# Altium schematic sheet Demo1.SchDoc
size A4; SheetNumber: 1; SheetTotal: 1
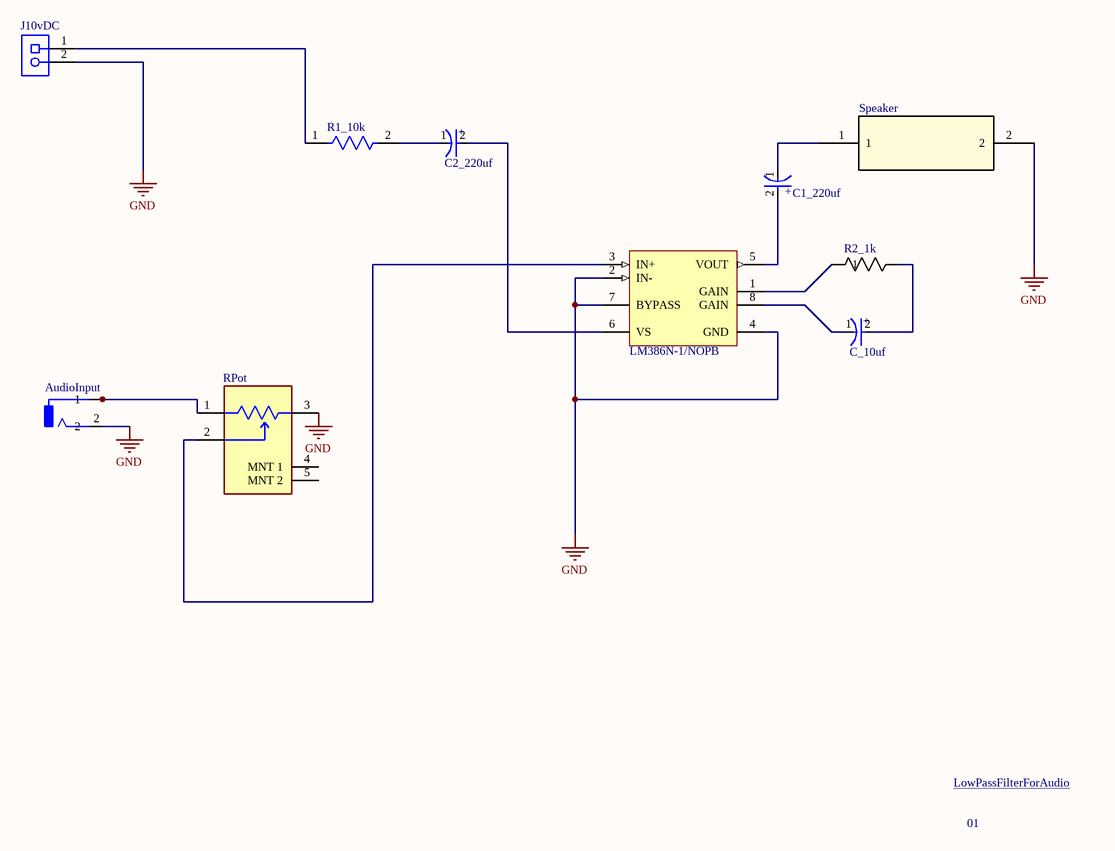
[diagram p0: Demo1.SchDoc]

## Parts
AudioInput  RCJ-021  [CUI_RCJ-021]  (value not drawn)
C1_220uf  ECA2AHG221B  [FP-RAD-TH-D_12_5_0_5-L_25-MFG]  (value not drawn)
C2_220uf  ECA2AHG221B  [FP-RAD-TH-D_12_5_0_5-L_25-MFG]  (value not drawn)
C_10uf  ECA1HHG100I  [FP-RAD-TH-D_5_0_5-L_11_1-MFG]  (value not drawn)
J10vDC  1729128  [PHOE-1729128-2_V]  (value not drawn)
R1_10k  SP3AJT10R0  [FP-SP3A-MFG]  (value not drawn)
R2_1k  CF14JT1K00  [STA_CF14_STP]  (value not drawn)
RPot  PTV09A-4225F-B103  [FP-PTV09A-4-MFG]  (value not drawn)
Speaker  SM231508-1  [SPEAK_SM231508-1_DBU]  (value not drawn)
U1  LM386N-1/NOPB  [P0008A]

## Nets
GND: AudioInput.2 J10vDC.2 RPot.3 Speaker.2 U1.2(IN-) U1.4(GND) U1.7(BYPASS)
NetAudioInput_1A: AudioInput.1A(1) AudioInput.1B RPot.1
NetC1_220uf_1: C1_220uf.1(C) Speaker.1
NetC1_220uf_2: C1_220uf.2(A) U1.5(VOUT)
NetC2_220uf_1: C2_220uf.1(C) R1_10k.2
NetC2_220uf_2: C2_220uf.2(A) U1.6(VS)
NetC_10uf_1: C_10uf.1(C) U1.8(GAIN)
NetC_10uf_2: C_10uf.2(A) R2_1k.2
NetJ10vDC_1: J10vDC.1 R1_10k.1
NetR2_1k_1: R2_1k.1 U1.1(GAIN)
NetRPot_2: RPot.2 U1.3(IN+)

Not connected (* = marked no-connect by the designer): RPot 4(MNT_1) 5(MNT_2)

## Notes on the sheet
- LowPassFilterForAudio <https://resources.altium.com/p/low-pass-filter-circuit>
- 01
- (in symbol CMP-05427-000260-1) +
- (in symbol CMP-05427-001770-1) +

## Library data of the parts
AudioInput = RCJ-021: 1 Port,  Vertical, Through Hole, Shielded, RCA Jack Connector; MF: CUI Devices; Value: *; CUI_purchase_URL: https://www.cuidevices.com/product/interconnect/connectors/rca-connectors/rcj-02-series?utm_source=snapeda.com&utm_medium=referral&utm_campaign=snapedaBOM; MP: RCJ-021; Price: None; Availability: Unavailable; Package: None; SnapEDA_Link: https://www.snapeda.com/parts/RCJ-021/CUI%20Devices/view-part/1320589/?ref=snap
C1_220uf C2_220uf = CMP-05427-001770-1: Aluminum Electrolytic Capacitors (Radial Lead Type) AEC-Q200 Qualified 220uF ±20% 100V; Ripple Current: 440mA; Lead/Base Style: Straight; Lead Diameter: 0.6mm; Life (Hours): 2000Hour; Min Operating Temperature: -55°C; Voltage Rating (DC): 100V; Tolerance: 20%; Lead Pitch: 5mm; Mount: Through Hole; Package Quantity: 500; Packaging: Ammo Pack; Max Operating Temperature: 105°C; Height - Seated (Max): 1.063inch; Width: 12.5mm; Voltage Rating: 100V; Radiation Hardening: No; Series: NHG; Length: 25mm; Height: 25mm; RoHS Compliant: Yes; Capacitance: 220uF; Diameter: 12.5mm; Case/Package: Radial; Termination: Radial
C_10uf = CMP-05427-000260-1: Aluminum Electrolytic Capacitors (Radial Lead Type) AEC-Q200 Qualified 10uF ±20% 50V; Lead Diameter: 0.5mm; Polarity: Polar; Leakage Current: 3uA; Life (Hours): 1000Hour; Ripple Current: 39mA; Lead/Base Style: Straight; Max Operating Temperature: 105°C; Voltage Rating (DC): 50V; Diameter: 5mm; RoHS Compliant: Yes; Capacitance: 10uF; Packaging: Ammo Pack; Series: NHG; Construction: RADIAL; Length: 11mm; Tolerance: 20%; Height - Seated (Max): 0.472inch; Contact Plating: Tin; Height: 11mm; Min Operating Temperature: -55°C; Radiation Hardening: No; Package Quantity: 2000; Mount: Through Hole; Voltage Rating: 50V; Lead Pitch: 2.5mm; Termination: Radial; Lead Free: Lead Free; Case/Package: Radial
J10vDC = CMP-2000-05815-1: PCB Terminal Block, 13.5 A, 400 V, 2-Pin THD, RoHS, Bulk; Manufacturer: Phoenix Contact; Package Version: 03/2015; No. of Rows: 1; Pitch: 5.08mm; No. of Positions: 2; Voltage Rating: 400V; Current Rating: 13500mA; Manufacturer URL: http://www.phoenixcontact.com/; Datasheet URL: https://datasheet.ciiva.com/16046/1729128-16046181.pdf; RoHS: TRUE; Package URL: https://www.phoenixcontact.com/online/portal/pi/pxc/product_detail_page/!ut/p/b1/3VdJjqNKFDxLH8AFycySyWY2ozFsEPOMMQaDOX1XedGL_1Vdm5YXJleknhSKeBkvI6EA8ncAo3AYoDhBQGco6KN7VURTdemj9us_IEKEZo_YHiPAEWEFmDGOHMORkqKYCORBZxgL7ZoaZYcbFFUZ3fqxSY6GOuxydWUuHqz1ynmMFygu583Bob0Ewr6Sd_l-5m-kAueHiB0jpRwZwe58wwtkpxtMYd_LmGcDRU02dRNEyWt6Y2ti5pSyJ_reIkzIulrqApdnbT11V5jnCKbYNCvhEM1MCpPByat_X379-iThf08CI5GfOPqfBeS3BRoBOdD55AKVv0iLwCMq-2BrzXWSGRH7pUGD9uwXQjiph3xL0DKQwdGa0JImiIOmBNOestqgwTHSSs2oOep-78apyXQBvNi8ZLaFjvjWvcaUEBu0MC6Wbe-d6mB0FAebo2lUWinqYaZs5DAYzV0RP9yitUjnGJ0iI9xhZkT42OCQNUJJhkgWINNQLP2JFP6OpMg3JCVg70jqHT0lvKOnhHf0lPuOnnLf0VPuWx6_dxwUIvwk5WMkT0kLL1mh61l2yZVSzG3pYV_bqo-mj6uMKwKwdnnW8Jh5RTOJzMOA5c-eJDaZQw4mTMPH02PvS_ZAqNVjVTo2WyYLkwH_KU1mmmG5kjRhDqPXLwwVHvVOjCM60-fpXvTDfMGW1PVFVS1r4e4yVDk4ZdNbkUHvqPqQSeian4UD39fNKmachqdJ1NJbyk8rXT9mXTvPk3oE5meulKGgiruPJek-4I9hTT6G8ZLOyRSm2RRVbThERQad5OS28hdt4YW4vG0stgYYzsWsK4_7y6DZMjJSCqri1kyiZR5vD7pwIrNR7QwPHTcLTI5qT7eRlpHrdGiupYlqQDJ7zy_CND8fWWBoLRXxk1RVcXiBQwbTD4Xi7KL-FuO94t9xaqweXzH; PartNumber: 1729128; Package Description: 2-Pin Through Hole Device, Body 8.1 x 10.16 mm, Pitch 5.08 mm; Datasheet Version: 12/2013; Mounting Technology: ThroughHole; Orientation: Horizontal; Package Reference: 1729128-2; Packing: Bulk
R1_10k = CMP-26528-000004-1: RES 10 OHM 5% 4W AXIAL; Resistance: 10R; Temperature Coefficient: 20ppm/°C; Power Rating: 4W; Series: SP; Mount: Through Hole; Diameter: 5.5mm; RoHS Compliant: Yes; Length: 12.7mm; Max Operating Temperature: 350°C; Max Power Dissipation: 4W; Number of Terminations: 2; Resistor Type: Wirewound; Min Operating Temperature: -55°C; Case/Package: Axial; Tolerance: 5%; Package Quantity: 1; Packaging: Cut Tape
R2_1k = CF14JT1K00: No Description Available; Mfr_Name: Stackpole International; Copyright: Copyright (C) 2022 Ultra Librarian. All rights reserved.; Manufacturer_Part_Number: CF14JT1K00; Digi-Key_Part_Number_1: CF14JT1K00CT-ND; Digi-Key_Part_Number_2: CF14JT1K00TR-ND; RefDes: RefDes; Type: DEV
RPot = CMP-07234-000052-1: POT 10K OHM 1/20W CARBON LINEAR; Power Rating: 50mW; Number of Gangs: 1; Hole Diameter: 9.1mm; Actuator Diameter: 0.236inch; Resistance Tolerance: 20%; Resistance: 10kR; Actuator Length: 0.984inch; Min Operating Temperature: -10°C; RoHS Compliant: Yes; Technology: CARBON FILM; Radiation Hardening: No; Taper: Linear; Military Standard: Not; Type: Potentiometer; Mount: Through Hole; Length: 11.4mm; Tolerance: 20%; Max Power Dissipation: 50mW; Max Operating Temperature: 50°C; Package Quantity: 100; Termination: PCB; Packaging: Bulk; Depth: 12.5mm; Resistor Type: Carbon; Number of Turns: 1; Series: Pro Audio PTV09; Height: 12.5mm; REACH SVHC: No SVHC
Speaker = SM231508-1: No Description Available; Mfr_Name: DB Products Ltd; Copyright: Copyright (C) 2022 Ultra Librarian. All rights reserved.; Manufacturer_Part_Number: SM231508-1; Digi-Key_Part_Number_1: 2104-SM231508-1-ND; RefDes: RefDes; Type: DEV
U1 = CMP-0057-00052-4: Low Voltage Audio Power Amplifier, 8-pin MDIP, Pb-Free; Manufacturer: Texas Instruments; PackageTopMarking: NSUZXYTTE#*LM*386N-1; PowerWise: N; CompType: Audio IC; RoHS: Y; PackageReference: P0008A; Code_JEDEC: MS-001-BA; PackageDescription: MDIP, .365 x .250 x .130in, 8 Lead, .100in Pitch; PinCount: 8; ComponentLink1URL: http://www.ti.com/general/docs/lit/getliterature.tsp?genericPartNumber=LM386&fileType=pdf; ComponentLink1Description: Datasheet URL